# Altium schematic sheet InterfacesB_NONISO422a.SchDoc
size A; DocumentNumber: 6; SheetNumber: 6
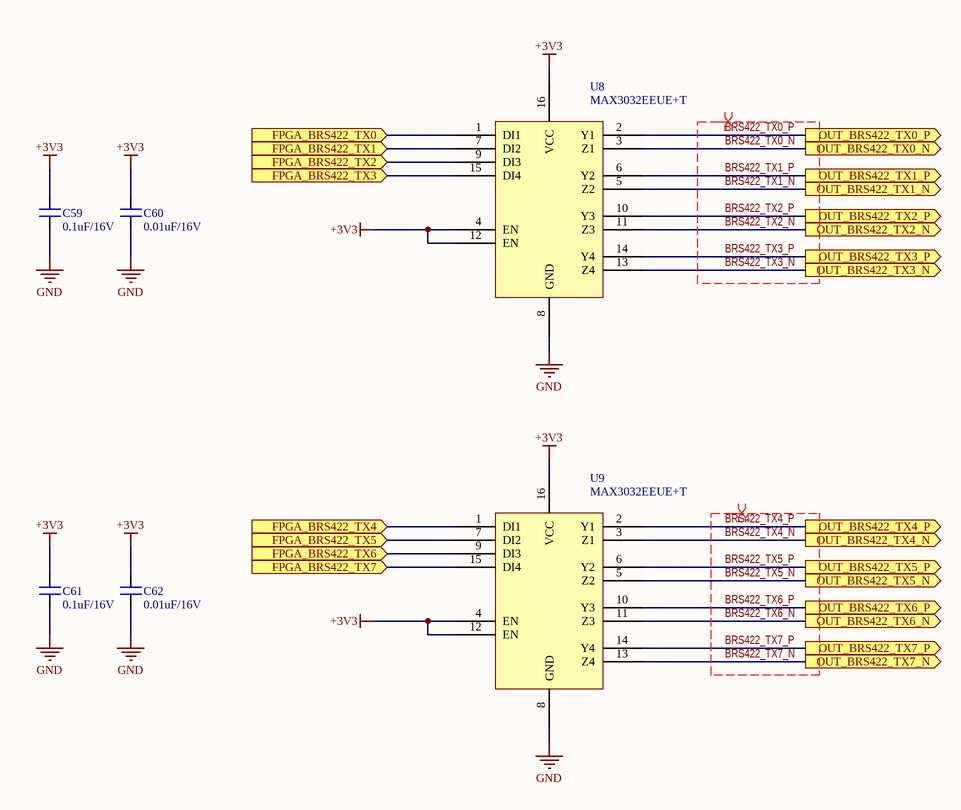
[diagram p0: InterfacesB_NONISO422a.SchDoc]

## Parts
C59  value 0.1uF/16V  [CAP_0805]  (hidden comment: CAP_0805)
C60  value 0.01uF/16V  [CAP_0805]  (hidden comment: CAP_0805)
C61  value 0.1uF/16V  [CAP_0805]  (hidden comment: CAP_0805)
C62  value 0.01uF/16V  [CAP_0805]  (hidden comment: CAP_0805)
U8  MAX3032EEUE+T  [MAX3032EEUE+T]
U9  MAX3032EEUE+T  [MAX3032EEUE+T]

## Ports
FPGA_BRS422_TX0 (in), FPGA_BRS422_TX1 (in), FPGA_BRS422_TX2 (in), FPGA_BRS422_TX3 (in), FPGA_BRS422_TX4 (in), FPGA_BRS422_TX5 (in), FPGA_BRS422_TX6 (in), FPGA_BRS422_TX7 (in), OUT_BRS422_TX0_N (out), OUT_BRS422_TX0_P (out), OUT_BRS422_TX1_N (out), OUT_BRS422_TX1_P (out), OUT_BRS422_TX2_N (out), OUT_BRS422_TX2_P (out), OUT_BRS422_TX3_N (out), OUT_BRS422_TX3_P (out), OUT_BRS422_TX4_N (out), OUT_BRS422_TX4_P (out), OUT_BRS422_TX5_N (out), OUT_BRS422_TX5_P (out), OUT_BRS422_TX6_N (out), OUT_BRS422_TX6_P (out), OUT_BRS422_TX7_N (out), OUT_BRS422_TX7_P (out)

## Nets
+3V3: C59.1 C60.1 C61.1 C62.1 U8.4(EN) U8.12(EN) U8.16(VCC) U9.4(EN) U9.12(EN) U9.16(VCC)
GND: C59.2 C60.2 C61.2 C62.2 U8.8(GND) U9.8(GND)
BRS422_TX0_N: U8.3(Z1) ; port OUT_BRS422_TX0_N
BRS422_TX0_P: U8.2(Y1) ; port OUT_BRS422_TX0_P
BRS422_TX1_N: U8.5(Z2) ; port OUT_BRS422_TX1_N
BRS422_TX1_P: U8.6(Y2) ; port OUT_BRS422_TX1_P
BRS422_TX2_N: U8.11(Z3) ; port OUT_BRS422_TX2_N
BRS422_TX2_P: U8.10(Y3) ; port OUT_BRS422_TX2_P
BRS422_TX3_N: U8.13(Z4) ; port OUT_BRS422_TX3_N
BRS422_TX3_P: U8.14(Y4) ; port OUT_BRS422_TX3_P
BRS422_TX4_N: U9.3(Z1) ; port OUT_BRS422_TX4_N
BRS422_TX4_P: U9.2(Y1) ; port OUT_BRS422_TX4_P
BRS422_TX5_N: U9.5(Z2) ; port OUT_BRS422_TX5_N
BRS422_TX5_P: U9.6(Y2) ; port OUT_BRS422_TX5_P
BRS422_TX6_N: U9.11(Z3) ; port OUT_BRS422_TX6_N
BRS422_TX6_P: U9.10(Y3) ; port OUT_BRS422_TX6_P
BRS422_TX7_N: U9.13(Z4) ; port OUT_BRS422_TX7_N
BRS422_TX7_P: U9.14(Y4) ; port OUT_BRS422_TX7_P
FPGA_BRS422_TX0: U8.1(DI1) ; port FPGA_BRS422_TX0
FPGA_BRS422_TX1: U8.7(DI2) ; port FPGA_BRS422_TX1
FPGA_BRS422_TX2: U8.9(DI3) ; port FPGA_BRS422_TX2
FPGA_BRS422_TX3: U8.15(DI4) ; port FPGA_BRS422_TX3
FPGA_BRS422_TX4: U9.1(DI1) ; port FPGA_BRS422_TX4
FPGA_BRS422_TX5: U9.7(DI2) ; port FPGA_BRS422_TX5
FPGA_BRS422_TX6: U9.9(DI3) ; port FPGA_BRS422_TX6
FPGA_BRS422_TX7: U9.15(DI4) ; port FPGA_BRS422_TX7

## Layout directives
differential pair: BRS422_TX0_N, BRS422_TX0_P, BRS422_TX1_N, BRS422_TX1_P, BRS422_TX2_N, BRS422_TX2_P, BRS422_TX3_N, BRS422_TX3_P, BRS422_TX4_N, BRS422_TX4_P, BRS422_TX5_N, BRS422_TX5_P, BRS422_TX6_N, BRS422_TX6_P, BRS422_TX7_N, BRS422_TX7_P

## Library data of the parts
U8 U9 = MAX3032EEUE+T: Supplier 1: Digi-Key; Supplier Part Number 1: 1016-1522-5-ND